# EAGLE design SHT31_Breakout_v1 (EAGLE 8.7.1)
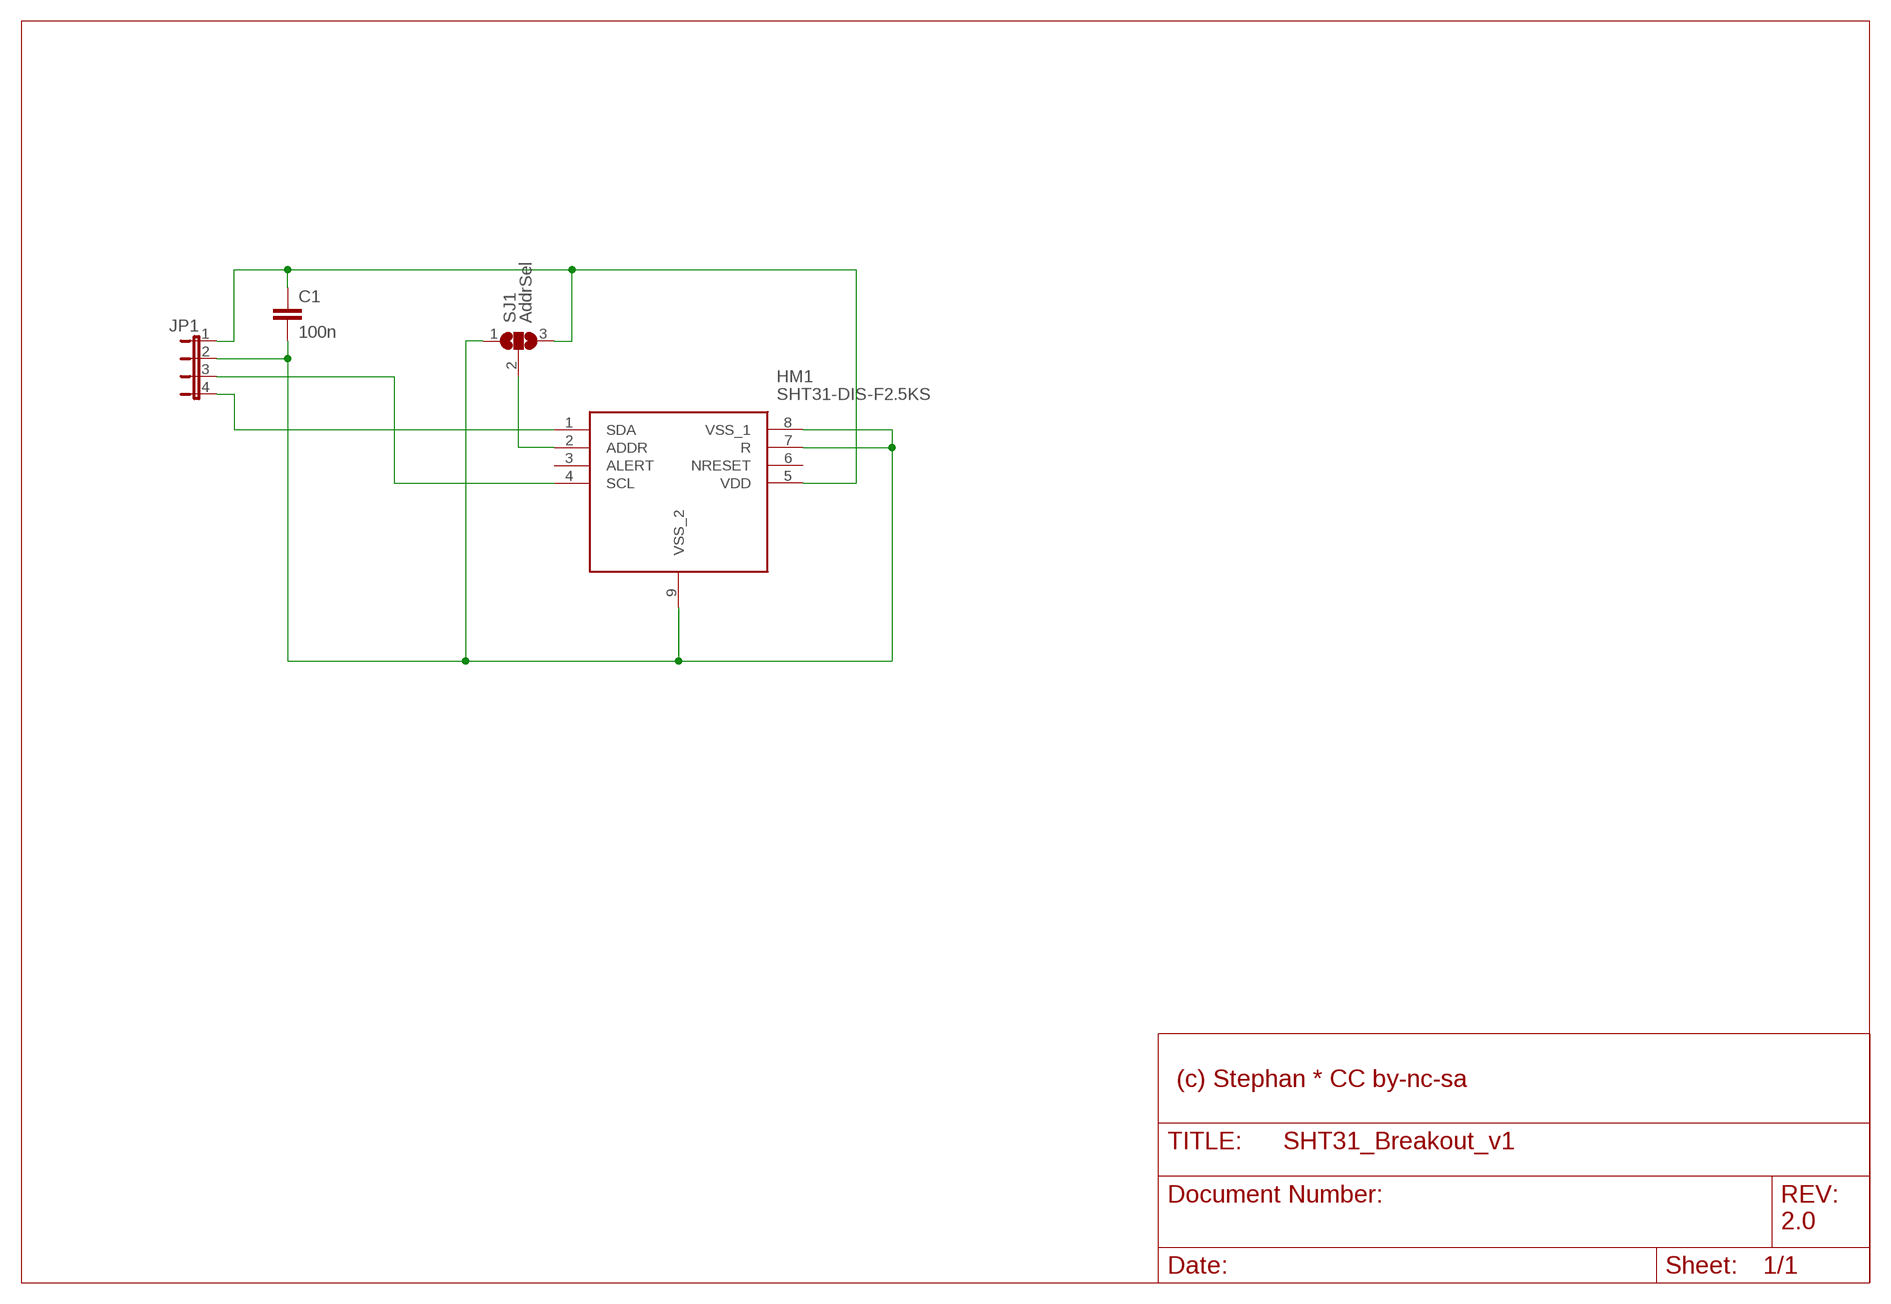
[diagram p0: schematic, sheet 1]

## Parts
C1  100n  C-EUC0603K  [C0603K]
HM1  SHT31-DIS-F2.5KS  [SON50P250X250X90-9N]
JP1  JP4E  [JP4]
SJ1  AddrSel  SJ2W  [SJ_2]

## Nets
3V3: C1.1 HM1.5(VDD) JP1.1 SJ1.3
ADDR: HM1.2(ADDR) SJ1.2
GND: C1.2 HM1.7(R) HM1.8(VSS_1) HM1.9(VSS_2) JP1.2 SJ1.1
SCL: HM1.4(SCL) JP1.3
SDA: HM1.1(SDA) JP1.4
Unconnected: HM1.3(ALERT) HM1.6(NRESET)

## Notes on the sheet
- (c) Stephan * CC by-nc-sa
- 2.0

## Library data of the parts
C1 = rcl:C-EU: CAPACITOR, European symbol
HM1 = SamacSys_Parts:SHT31-DIS-F2.5KS: Board Mount Humidity Sensors SHT3x Humidity and Temperature Sensor Source: Datasheet <https://componentsearchengine.com/Datasheets/1/SHT31-DIS-F2.5kS.pdf>; ARROW_PART_NUMBER: SHT31-DIS-F2.5KS; ARROW_PRICE-STOCK: https://www.arrow.com/en/products/sht31-dis-f2.5ks/sensirion-ag; DESCRIPTION: Board Mount Humidity Sensors SHT3x Humidity and Temperature Sensor; HEIGHT: 0.9mm; MANUFACTURER_NAME: Sensirion; MANUFACTURER_PART_NUMBER: SHT31-DIS-F2.5kS; MOUSER_PART_NUMBER: 403-SHT31-DIS-F; MOUSER_PRICE-STOCK: https://www.mouser.co.uk/ProductDetail/Sensirion/SHT31-DIS-F25kS?qs=SiS427jF8nOsxbyIRpupXg%3D%3D
JP1 = jumper:JP4E: JUMPER
SJ1 = jumper:SJ2W: SMD solder JUMPER

## Board
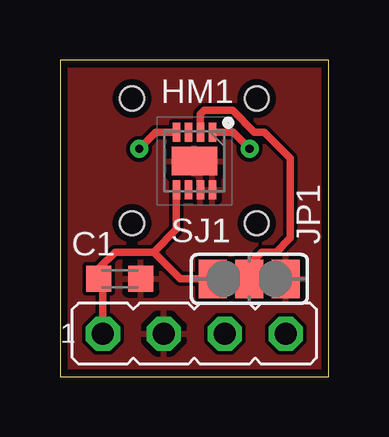
[diagram p1: board, top side]
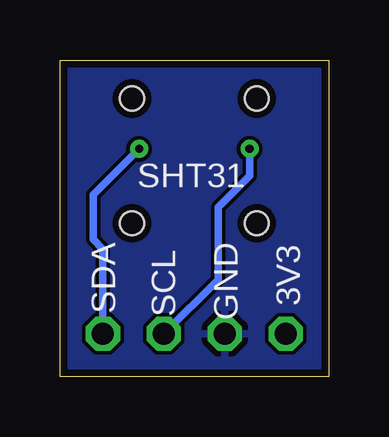
[diagram p2: board, bottom side, seen from below]

Size 11.2 x 13.2 mm. Coordinates in mm from the lower left corner, seen from the top.
Outline: 0,0 11.2,0 11.2,13.2 0,13.2 0,0
Copper layers (1*16): Top 0.035mm / dielectric 1.5mm / Bottom 0.035mm
Design rules "DRC23Jun21": minimum track width 6mil, minimum drill 0.35mm, track to track 6mil, track to pad 6mil, pad to pad 6mil, via to via 6mil, smd to smd 6mil, copper to edge 0.3mm, drill to drill 6mil, minimum pad ring 10mil, minimum via ring 8mil, stop-mask expansion 4mil, vias tented up to drill 0.4mm, thermal gap 10mil
Holes 1 mm at 3,11.6 8.2,11.6 8.2,6.4 3,6.4

### Footprints (pad centres in the part's own frame; a part is rotated, then mirrored left to right if it is on the bottom)
C0603K = smd 1.05 x 1.08: 1 -0.875,0; 2 0.875,0
SON50P250X250X90-9N = smd 0.8 x 0.3: 1 -1.2,0.75; 2 -1.2,0.25; 3 -1.2,-0.25; 4 -1.2,-0.75; 5 1.2,-0.75; 6 1.2,-0.25; 7 1.2,0.25; 8 1.2,0.75 | smd 1.2 x 1.9: 9 0,0
JP4 = drill 0.914 octagon: 1 -3.81,0; 2 -1.27,0; 3 1.27,0; 4 3.81,0
SJ_2 = smd 1.168 x 1.6: 1 -1.524,0; 2 0,0; 3 1.524,0

### Placement (x,y rotation side)
C1  2.49,4.09 0 top
HM1  5.6,8.99 270 top
JP1  5.6,1.8 0 top
SJ1  7.89,4.08 180 top

### Tracks (layer width: path | path; a pad name or v marks a point on that pad's centre or on a via)
3V3
  Top 0.2: 1.79,3.92 C1.1
  Top 0.305: JP1.1 1.79,3.92 | HM1.5 4.85,6.15 3.9,5.2 | 3.9,5.2 2.3,5.2 1.61,4.51 C1.1 | 3.9,5.2 5.02,4.08 SJ1.3
ADDR
  Top 0.2: 7.89,4.69 SJ1.2
  Top 0.305: HM1.2 5.85,10.95 6,11.1 7.19,11.1 8.09,10.2 8.5,10.2 9.6,9.1 9.6,5.8 9,5.2 8.4,5.2 7.89,4.69
GND
  pour Top: 0,0 0,13.2 11.2,13.2 11.2,0
  pour Bottom: -0.2,13.4 11.5,13.4 11.5,-0.2 -0.2,-0.2
SCL  (via drill 0.35)
  Top 0.305: HM1.4 3.99,10.19 v3.3,9.5
  Bottom 0.305: v3.3,9.5 3.3,8.38 4.62,7.07 4.62,4.05 JP1.3
SDA  (via drill 0.35)
  Top 0.305: HM1.1 7.21,10.19 v7.9,9.5
  Bottom 0.305: JP1.4 9.41,5.33 9.82,5.73 9.82,7.58 v7.9,9.5

### Text on the board
bNames: SHT31 | 3V3 | GND | SDA | SCL